# Altium project Fastino-DIOT.PrjPCB (part 8 of 8)
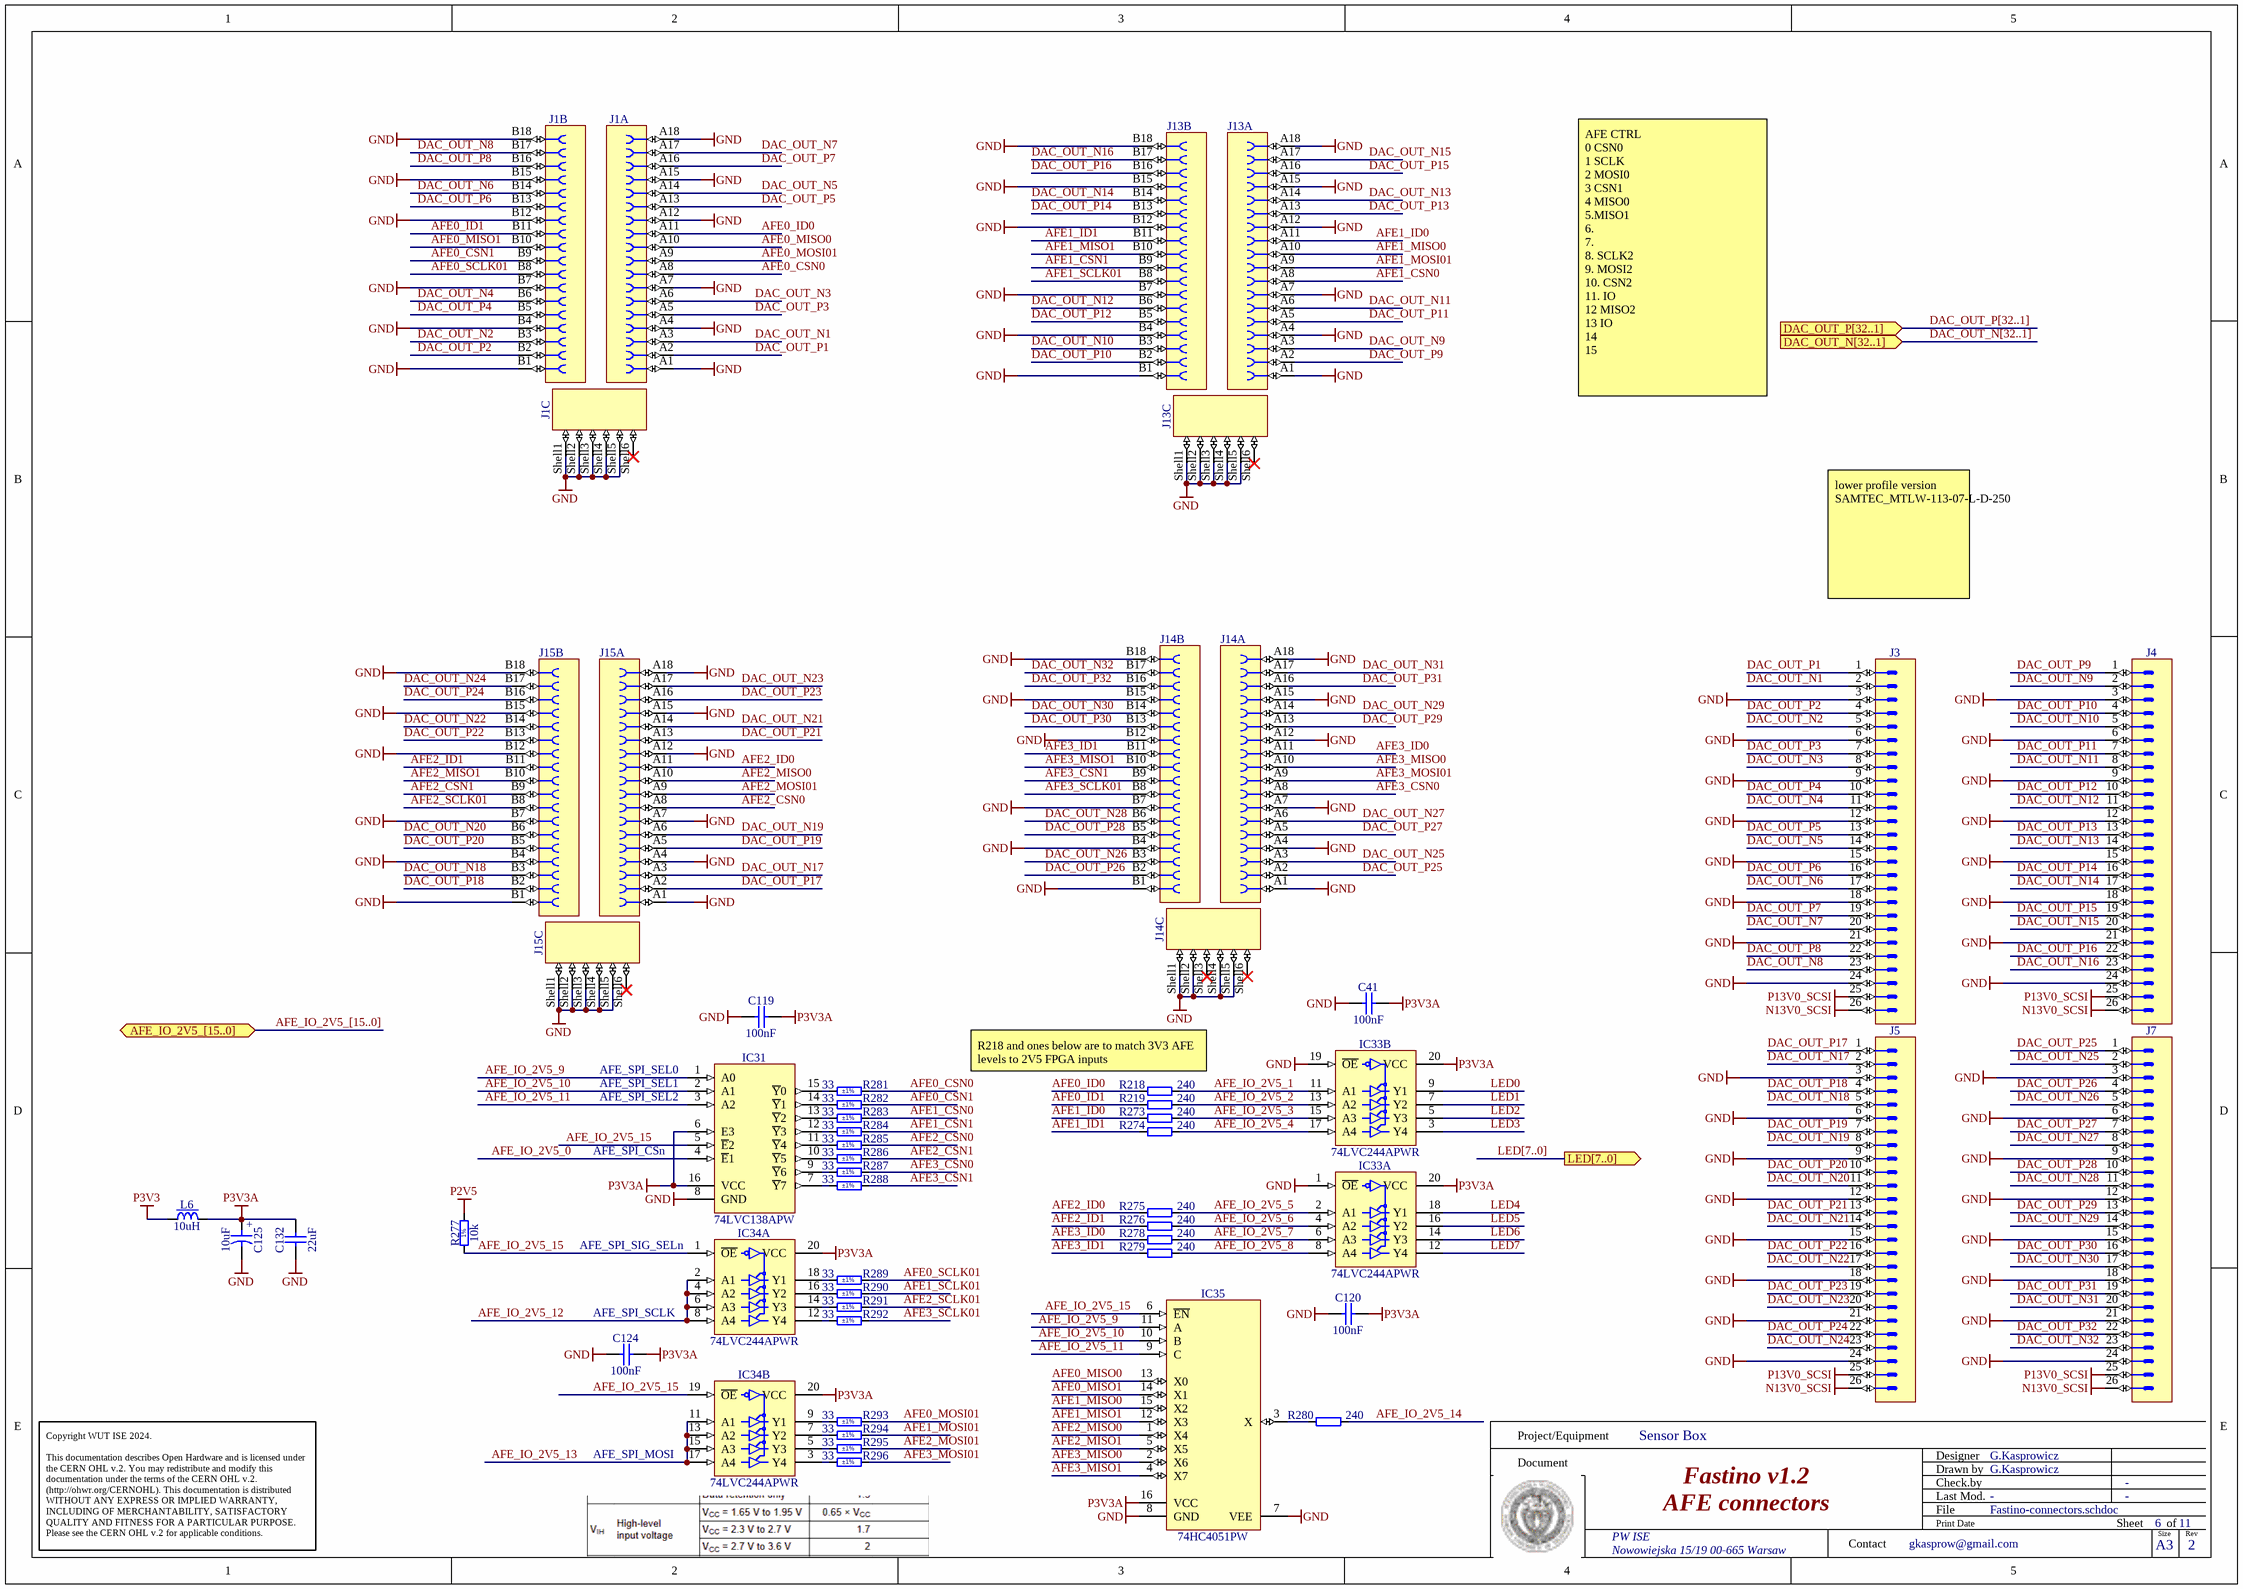
[diagram p12: Fastino-connectors.schdoc]

## Nets that join several sheets
GND: Fastino-DIOT (16 pins), DAC_channel1 (22 pins), DAC_channel2 (22 pins), DAC_channel3 (22 pins), DAC_channel4 (22 pins), DAC_channel5 (22 pins), DAC_channel6 (22 pins), DAC_channel7 (22 pins), DAC_channel8 (22 pins), DAC_channel9 (22 pins), DAC_channel10 (22 pins), DAC_channel11 (22 pins), DAC_channel12 (22 pins), DAC_channel13 (22 pins), DAC_channel14 (22 pins), DAC_channel15 (22 pins), DAC_channel16 (22 pins), DAC_channel17 (22 pins), DAC_channel18 (22 pins), DAC_channel19 (22 pins), DAC_channel20 (22 pins), DAC_channel21 (22 pins), DAC_channel22 (22 pins), DAC_channel23 (22 pins), DAC_channel24 (22 pins), DAC_channel25 (22 pins), DAC_channel26 (22 pins), DAC_channel27 (22 pins), DAC_channel28 (22 pins), DAC_channel29 (22 pins), DAC_channel30 (22 pins), DAC_channel31 (22 pins), DAC_channel32 (22 pins), Fastino_FPGA (6 pins), Fastino_FPGA_Config (18 pins), Fastino_FPGA_LVDS (42 pins), Fastino_FPGA_Supply (44 pins), Fastino_References (55 pins), Fastino_Supply (55 pins), Fastino_Supply_Switching (111 pins), Fastino_DIOT_Connectors_P1_P6 (96 pins), Fastino-connectors (112 pins)
N12V0A: DAC_channel1 (L18_1.1), DAC_channel2 (L18_2.1), DAC_channel3 (L18_3.1), DAC_channel4 (L18_4.1), DAC_channel5 (L18_5.1), DAC_channel6 (L18_6.1), DAC_channel7 (L18_7.1), DAC_channel8 (L18_8.1), DAC_channel9 (L18_9.1), DAC_channel10 (L18_10.1), DAC_channel11 (L18_11.1), DAC_channel12 (L18_12.1), DAC_channel13 (L18_13.1), DAC_channel14 (L18_14.1), DAC_channel15 (L18_15.1), DAC_channel16 (L18_16.1), DAC_channel17 (L18_17.1), DAC_channel18 (L18_18.1), DAC_channel19 (L18_19.1), DAC_channel20 (L18_20.1), DAC_channel21 (L18_21.1), DAC_channel22 (L18_22.1), DAC_channel23 (L18_23.1), DAC_channel24 (L18_24.1), DAC_channel25 (L18_25.1), DAC_channel26 (L18_26.1), DAC_channel27 (L18_27.1), DAC_channel28 (L18_28.1), DAC_channel29 (L18_29.1), DAC_channel30 (L18_30.1), DAC_channel31 (L18_31.1), DAC_channel32 (L18_32.1), Fastino_Supply (10 pins)
N13V0: Fastino-DIOT (R170.1), Fastino_Supply (5 pins), Fastino_Supply_Switching (C153.2 C156.2 L8.2)
N13V0_SCSI: Fastino-DIOT (R170.2), Fastino-connectors (J3.26 J4.26 J5.26 J7.26)
P1V2: Fastino_FPGA_Supply (16 pins), Fastino_Supply (R76.2 TP5.1), Fastino_Supply_Switching (6 pins)
P2V5: Fastino_FPGA_Supply (11 pins), Fastino_Supply (R152.2 TP10.1), Fastino_Supply_Switching (5 pins), Fastino-connectors (R277.2)
P3V3: Fastino_FPGA (C85.2 OSC1.1 OSC1.4 R53.1), Fastino_FPGA_Config (8 pins), Fastino_FPGA_LVDS (R74.1 R78.1 R84.1 R110.1), Fastino_FPGA_Supply (24 pins), Fastino_Supply (R51.1 R103.2 R159.1 TP11.1), Fastino_Supply_Switching (7 pins), Fastino-connectors (L6.1)
P3V3_buck: Fastino_Supply (R54.1), Fastino_Supply_Switching (14 pins)
P3V3_MP: Fastino-DIOT (J12.12), Fastino_FPGA_Config (15 pins), Fastino_FPGA_LVDS (22 pins), Fastino_Supply (R160.1 TP8.1), Fastino_DIOT_Connectors_P1_P6 (D7.1)
P3V3A: Fastino_FPGA_Config (LD18.2), Fastino_FPGA_LVDS (LD19.2), Fastino_Supply (LD1.2 R52.1), Fastino-connectors (12 pins)
P5V4A: DAC_channel1 (L16_1.1 R164_1.1), DAC_channel2 (L16_2.1 R164_2.1), DAC_channel3 (L16_3.1 R164_3.1), DAC_channel4 (L16_4.1 R164_4.1), DAC_channel5 (L16_5.1 R164_5.1), DAC_channel6 (L16_6.1 R164_6.1), DAC_channel7 (L16_7.1 R164_7.1), DAC_channel8 (L16_8.1 R164_8.1), DAC_channel9 (L16_9.1 R164_9.1), DAC_channel10 (L16_10.1 R164_10.1), DAC_channel11 (L16_11.1 R164_11.1), DAC_channel12 (L16_12.1 R164_12.1), DAC_channel13 (L16_13.1 R164_13.1), DAC_channel14 (L16_14.1 R164_14.1), DAC_channel15 (L16_15.1 R164_15.1), DAC_channel16 (L16_16.1 R164_16.1), DAC_channel17 (L16_17.1 R164_17.1), DAC_channel18 (L16_18.1 R164_18.1), DAC_channel19 (L16_19.1 R164_19.1), DAC_channel20 (L16_20.1 R164_20.1), DAC_channel21 (L16_21.1 R164_21.1), DAC_channel22 (L16_22.1 R164_22.1), DAC_channel23 (L16_23.1 R164_23.1), DAC_channel24 (L16_24.1 R164_24.1), DAC_channel25 (L16_25.1 R164_25.1), DAC_channel26 (L16_26.1 R164_26.1), DAC_channel27 (L16_27.1 R164_27.1), DAC_channel28 (L16_28.1 R164_28.1), DAC_channel29 (L16_29.1 R164_29.1), DAC_channel30 (L16_30.1 R164_30.1), DAC_channel31 (L16_31.1 R164_31.1), DAC_channel32 (L16_32.1 R164_32.1), Fastino_References (29 pins), Fastino_Supply (8 pins)
P6V0: Fastino_Supply (R7.1 TP13.1), Fastino_Supply_Switching (6 pins)
P6V0A: Fastino_Supply (6 pins), Fastino_Supply_Switching (C58.2 D4.1 L1.2 R28.1)
P12V0: Fastino-DIOT (J12.1 J12.3 J12.5 J12.7), Fastino_FPGA_LVDS (8 pins), Fastino_Supply (5 pins), Fastino_DIOT_Connectors_P1_P6 (J2.A3 J2.B3)
P12V0_CPCIS: Fastino_FPGA_LVDS (R268.1 R269.1 R270.1 R271.1), Fastino_DIOT_Connectors_P1_P6 (10 pins)
P12V0A: DAC_channel1 (L2_1.1), DAC_channel2 (L2_2.1), DAC_channel3 (L2_3.1), DAC_channel4 (L2_4.1), DAC_channel5 (L2_5.1), DAC_channel6 (L2_6.1), DAC_channel7 (L2_7.1), DAC_channel8 (L2_8.1), DAC_channel9 (L2_9.1), DAC_channel10 (L2_10.1), DAC_channel11 (L2_11.1), DAC_channel12 (L2_12.1), DAC_channel13 (L2_13.1), DAC_channel14 (L2_14.1), DAC_channel15 (L2_15.1), DAC_channel16 (L2_16.1), DAC_channel17 (L2_17.1), DAC_channel18 (L2_18.1), DAC_channel19 (L2_19.1), DAC_channel20 (L2_20.1), DAC_channel21 (L2_21.1), DAC_channel22 (L2_22.1), DAC_channel23 (L2_23.1), DAC_channel24 (L2_24.1), DAC_channel25 (L2_25.1), DAC_channel26 (L2_26.1), DAC_channel27 (L2_27.1), DAC_channel28 (L2_28.1), DAC_channel29 (L2_29.1), DAC_channel30 (L2_30.1), DAC_channel31 (L2_31.1), DAC_channel32 (L2_32.1), Fastino_Supply (9 pins)
P12V0F: Fastino_Supply (C34.2 C49.1 L5.2), Fastino_Supply_Switching (18 pins)
P13V0: Fastino-DIOT (R171.1), Fastino_Supply (C18.2 C112.2 IC13.1 IC13.2), Fastino_Supply_Switching (C82.2 C93.2 L4.2)
P13V0_SCSI: Fastino-DIOT (R171.2), Fastino-connectors (J3.25 J4.25 J5.25 J7.25)
Vaux1: Fastino_References (RN2.4), Fastino_DIOT_Connectors_P1_P6 (J2.A1 J2.B1 J2.D1 J2.E1)
Vaux2: Fastino_References (RN2.1), Fastino_DIOT_Connectors_P1_P6 (J2.G1 J2.H1 J2.J1 J2.K1)
AFE_IO_2V5_0: Fastino_FPGA_LVDS (U1.L3), Fastino-connectors (IC31.4)
AFE_IO_2V5_1: Fastino_FPGA_LVDS (U1.L6), Fastino-connectors (IC33.11 R218.2)
AFE_IO_2V5_2: Fastino_FPGA_LVDS (U1.M2), Fastino-connectors (IC33.13 R219.2)
AFE_IO_2V5_3: Fastino_FPGA_LVDS (U1.K5), Fastino-connectors (IC33.15 R273.2)
AFE_IO_2V5_4: Fastino_FPGA_LVDS (U1.N2), Fastino-connectors (IC33.17 R274.2)
AFE_IO_2V5_5: Fastino_FPGA_LVDS (U1.L7), Fastino-connectors (IC33.2 R275.2)
AFE_IO_2V5_6: Fastino_FPGA_LVDS (U1.M3), Fastino-connectors (IC33.4 R276.2)
AFE_IO_2V5_7: Fastino_FPGA_LVDS (U1.M6), Fastino-connectors (IC33.6 R278.2)
AFE_IO_2V5_8: Fastino_FPGA_LVDS (U1.N3), Fastino-connectors (IC33.8 R279.2)
AFE_IO_2V5_9: Fastino_FPGA_LVDS (U1.L5), Fastino-connectors (IC31.1 IC35.11)
AFE_IO_2V5_10: Fastino_FPGA_LVDS (U1.M4), Fastino-connectors (IC31.2 IC35.10)
AFE_IO_2V5_11: Fastino_FPGA_LVDS (U1.P1), Fastino-connectors (IC31.3 IC35.9)
AFE_IO_2V5_12: Fastino_FPGA_LVDS (U1.M5), Fastino-connectors (IC34.2 IC34.4 IC34.6 IC34.8)
AFE_IO_2V5_13: Fastino_FPGA_LVDS (U1.P2), Fastino-connectors (IC34.11 IC34.13 IC34.15 IC34.17)
AFE_IO_2V5_14: Fastino_FPGA_LVDS (U1.N4), Fastino-connectors (R280.2)
AFE_IO_2V5_15: Fastino_FPGA_LVDS (U1.R1), Fastino-connectors (5 pins)
BP_I2C.SCL: Fastino_FPGA_LVDS (R233.1), Fastino_DIOT_Connectors_P1_P6 (D5.3 J8.B2)
BP_I2C.SDA: Fastino_FPGA_LVDS (R3.1), Fastino_DIOT_Connectors_P1_P6 (D5.1 J8.C2)
BP_IO.LVDS_N0: Fastino_FPGA_LVDS (R252.1), Fastino_DIOT_Connectors_P1_P6 (J8.E3)
BP_IO.LVDS_N1: Fastino_FPGA_LVDS (R253.1), Fastino_DIOT_Connectors_P1_P6 (J8.B3)
BP_IO.LVDS_N2: Fastino_FPGA_LVDS (R254.1), Fastino_DIOT_Connectors_P1_P6 (J8.C4)
BP_IO.LVDS_N3: Fastino_FPGA_LVDS (R255.1), Fastino_DIOT_Connectors_P1_P6 (J8.L4)
BP_IO.LVDS_N4: Fastino_FPGA_LVDS (R256.1), Fastino_DIOT_Connectors_P1_P6 (J8.I4)
BP_IO.LVDS_N5: Fastino_FPGA_LVDS (R257.1), Fastino_DIOT_Connectors_P1_P6 (J8.K5)
BP_IO.LVDS_N6: Fastino_FPGA_LVDS (R258.1), Fastino_DIOT_Connectors_P1_P6 (J8.H5)
BP_IO.LVDS_N7: Fastino_FPGA_LVDS (R259.1), Fastino_DIOT_Connectors_P1_P6 (J8.F6)
BP_IO.LVDS_N8: Fastino_FPGA_LVDS (R260.1), Fastino_DIOT_Connectors_P1_P6 (J8.C6)
BP_IO.LVDS_N9: Fastino_FPGA_LVDS (R261.1), Fastino_DIOT_Connectors_P1_P6 (J8.L6)
BP_IO.LVDS_N10: Fastino_FPGA_LVDS (R262.1), Fastino_DIOT_Connectors_P1_P6 (J8.I6)
BP_IO.LVDS_N11: Fastino_FPGA_LVDS (R263.1), Fastino_DIOT_Connectors_P1_P6 (J9.E1)
BP_IO.LVDS_N12: Fastino_FPGA_LVDS (R264.1), Fastino_DIOT_Connectors_P1_P6 (J9.B1)
BP_IO.LVDS_N13: Fastino_FPGA_LVDS (R265.1), Fastino_DIOT_Connectors_P1_P6 (J9.K1)
BP_IO.LVDS_N14: Fastino_FPGA_LVDS (R266.1), Fastino_DIOT_Connectors_P1_P6 (J9.H1)
BP_IO.LVDS_N15: Fastino_FPGA_LVDS (R267.2), Fastino_DIOT_Connectors_P1_P6 (J8.F2)
BP_IO.LVDS_P0: Fastino_FPGA_LVDS (R235.1), Fastino_DIOT_Connectors_P1_P6 (J8.D3)
BP_IO.LVDS_P1: Fastino_FPGA_LVDS (R236.1), Fastino_DIOT_Connectors_P1_P6 (J8.A3)
BP_IO.LVDS_P2: Fastino_FPGA_LVDS (R238.1), Fastino_DIOT_Connectors_P1_P6 (J8.B4)
BP_IO.LVDS_P3: Fastino_FPGA_LVDS (R239.1), Fastino_DIOT_Connectors_P1_P6 (J8.K4)
BP_IO.LVDS_P4: Fastino_FPGA_LVDS (R240.1), Fastino_DIOT_Connectors_P1_P6 (J8.H4)
BP_IO.LVDS_P5: Fastino_FPGA_LVDS (R241.1), Fastino_DIOT_Connectors_P1_P6 (J8.J5)
BP_IO.LVDS_P6: Fastino_FPGA_LVDS (R242.1), Fastino_DIOT_Connectors_P1_P6 (J8.G5)
BP_IO.LVDS_P7: Fastino_FPGA_LVDS (R243.1), Fastino_DIOT_Connectors_P1_P6 (J8.E6)
BP_IO.LVDS_P8: Fastino_FPGA_LVDS (R244.1), Fastino_DIOT_Connectors_P1_P6 (J8.B6)
BP_IO.LVDS_P9: Fastino_FPGA_LVDS (R245.1), Fastino_DIOT_Connectors_P1_P6 (J8.K6)
BP_IO.LVDS_P10: Fastino_FPGA_LVDS (R246.1), Fastino_DIOT_Connectors_P1_P6 (J8.H6)
BP_IO.LVDS_P11: Fastino_FPGA_LVDS (R247.1), Fastino_DIOT_Connectors_P1_P6 (J9.D1)
BP_IO.LVDS_P12: Fastino_FPGA_LVDS (R248.1), Fastino_DIOT_Connectors_P1_P6 (J9.A1)
BP_IO.LVDS_P13: Fastino_FPGA_LVDS (R249.1), Fastino_DIOT_Connectors_P1_P6 (J9.J1)
BP_IO.LVDS_P14: Fastino_FPGA_LVDS (R250.1), Fastino_DIOT_Connectors_P1_P6 (J9.G1)
BP_IO.LVDS_P15: Fastino_FPGA_LVDS (R251.2), Fastino_DIOT_Connectors_P1_P6 (J8.E2)
DAC_CLK1: DAC_channel1 (C66_1.1 IC37_1.8), DAC_Series_Termination1 (R65_1.2)
DAC_CLK2: DAC_channel2 (C66_2.1 IC37_2.8), DAC_Series_Termination2 (R65_2.2)
DAC_CLK3: DAC_channel3 (C66_3.1 IC37_3.8), DAC_Series_Termination3 (R65_3.2)
DAC_CLK4: DAC_channel4 (C66_4.1 IC37_4.8), DAC_Series_Termination4 (R65_4.2)
DAC_CLK5: DAC_channel5 (C66_5.1 IC37_5.8), DAC_Series_Termination5 (R65_5.2)
DAC_CLK6: DAC_channel6 (C66_6.1 IC37_6.8), DAC_Series_Termination6 (R65_6.2)
DAC_CLK7: DAC_channel7 (C66_7.1 IC37_7.8), DAC_Series_Termination7 (R65_7.2)
DAC_CLK8: DAC_channel8 (C66_8.1 IC37_8.8), DAC_Series_Termination8 (R65_8.2)
DAC_CLK9: DAC_channel9 (C66_9.1 IC37_9.8), DAC_Series_Termination9 (R65_9.2)
DAC_CLK10: DAC_channel10 (C66_10.1 IC37_10.8), DAC_Series_Termination10 (R65_10.2)
DAC_CLK11: DAC_channel11 (C66_11.1 IC37_11.8), DAC_Series_Termination11 (R65_11.2)
DAC_CLK12: DAC_channel12 (C66_12.1 IC37_12.8), DAC_Series_Termination12 (R65_12.2)
DAC_CLK13: DAC_channel13 (C66_13.1 IC37_13.8), DAC_Series_Termination13 (R65_13.2)
DAC_CLK14: DAC_channel14 (C66_14.1 IC37_14.8), DAC_Series_Termination14 (R65_14.2)
DAC_CLK15: DAC_channel15 (C66_15.1 IC37_15.8), DAC_Series_Termination15 (R65_15.2)
DAC_CLK16: DAC_channel16 (C66_16.1 IC37_16.8), DAC_Series_Termination16 (R65_16.2)
DAC_CLK17: DAC_channel17 (C66_17.1 IC37_17.8), DAC_Series_Termination17 (R65_17.2)
DAC_CLK18: DAC_channel18 (C66_18.1 IC37_18.8), DAC_Series_Termination18 (R65_18.2)
DAC_CLK19: DAC_channel19 (C66_19.1 IC37_19.8), DAC_Series_Termination19 (R65_19.2)
DAC_CLK20: DAC_channel20 (C66_20.1 IC37_20.8), DAC_Series_Termination20 (R65_20.2)
DAC_CLK21: DAC_channel21 (C66_21.1 IC37_21.8), DAC_Series_Termination21 (R65_21.2)
DAC_CLK22: DAC_channel22 (C66_22.1 IC37_22.8), DAC_Series_Termination22 (R65_22.2)
DAC_CLK23: DAC_channel23 (C66_23.1 IC37_23.8), DAC_Series_Termination23 (R65_23.2)
DAC_CLK24: DAC_channel24 (C66_24.1 IC37_24.8), DAC_Series_Termination24 (R65_24.2)
DAC_CLK25: DAC_channel25 (C66_25.1 IC37_25.8), DAC_Series_Termination25 (R65_25.2)
DAC_CLK26: DAC_channel26 (C66_26.1 IC37_26.8), DAC_Series_Termination26 (R65_26.2)
DAC_CLK27: DAC_channel27 (C66_27.1 IC37_27.8), DAC_Series_Termination27 (R65_27.2)
DAC_CLK28: DAC_channel28 (C66_28.1 IC37_28.8), DAC_Series_Termination28 (R65_28.2)
DAC_CLK29: DAC_channel29 (C66_29.1 IC37_29.8), DAC_Series_Termination29 (R65_29.2)
DAC_CLK30: DAC_channel30 (C66_30.1 IC37_30.8), DAC_Series_Termination30 (R65_30.2)
DAC_CLK31: DAC_channel31 (C66_31.1 IC37_31.8), DAC_Series_Termination31 (R65_31.2)
DAC_CLK32: Fastino-DIOT (TP4.1), DAC_channel32 (C66_32.1 IC37_32.8), DAC_Series_Termination32 (R65_32.2)
DAC_LDACn1: DAC_channel1 (C89_1.1 IC37_1.11), DAC_Series_Termination1 (R80_1.2)
DAC_LDACn2: DAC_channel2 (C89_2.1 IC37_2.11), DAC_Series_Termination2 (R80_2.2)
DAC_LDACn3: DAC_channel3 (C89_3.1 IC37_3.11), DAC_Series_Termination3 (R80_3.2)
DAC_LDACn4: DAC_channel4 (C89_4.1 IC37_4.11), DAC_Series_Termination4 (R80_4.2)
DAC_LDACn5: DAC_channel5 (C89_5.1 IC37_5.11), DAC_Series_Termination5 (R80_5.2)
DAC_LDACn6: DAC_channel6 (C89_6.1 IC37_6.11), DAC_Series_Termination6 (R80_6.2)
DAC_LDACn7: DAC_channel7 (C89_7.1 IC37_7.11), DAC_Series_Termination7 (R80_7.2)
DAC_LDACn8: DAC_channel8 (C89_8.1 IC37_8.11), DAC_Series_Termination8 (R80_8.2)
DAC_LDACn9: DAC_channel9 (C89_9.1 IC37_9.11), DAC_Series_Termination9 (R80_9.2)
DAC_LDACn10: DAC_channel10 (C89_10.1 IC37_10.11), DAC_Series_Termination10 (R80_10.2)
DAC_LDACn11: DAC_channel11 (C89_11.1 IC37_11.11), DAC_Series_Termination11 (R80_11.2)
DAC_LDACn12: DAC_channel12 (C89_12.1 IC37_12.11), DAC_Series_Termination12 (R80_12.2)
DAC_LDACn13: DAC_channel13 (C89_13.1 IC37_13.11), DAC_Series_Termination13 (R80_13.2)
DAC_LDACn14: DAC_channel14 (C89_14.1 IC37_14.11), DAC_Series_Termination14 (R80_14.2)
DAC_LDACn15: DAC_channel15 (C89_15.1 IC37_15.11), DAC_Series_Termination15 (R80_15.2)
DAC_LDACn16: DAC_channel16 (C89_16.1 IC37_16.11), DAC_Series_Termination16 (R80_16.2)
DAC_LDACn17: DAC_channel17 (C89_17.1 IC37_17.11), DAC_Series_Termination17 (R80_17.2)
DAC_LDACn18: DAC_channel18 (C89_18.1 IC37_18.11), DAC_Series_Termination18 (R80_18.2)
DAC_LDACn19: DAC_channel19 (C89_19.1 IC37_19.11), DAC_Series_Termination19 (R80_19.2)
DAC_LDACn20: DAC_channel20 (C89_20.1 IC37_20.11), DAC_Series_Termination20 (R80_20.2)
DAC_LDACn21: DAC_channel21 (C89_21.1 IC37_21.11), DAC_Series_Termination21 (R80_21.2)
DAC_LDACn22: DAC_channel22 (C89_22.1 IC37_22.11), DAC_Series_Termination22 (R80_22.2)
DAC_LDACn23: DAC_channel23 (C89_23.1 IC37_23.11), DAC_Series_Termination23 (R80_23.2)
DAC_LDACn24: DAC_channel24 (C89_24.1 IC37_24.11), DAC_Series_Termination24 (R80_24.2)
DAC_LDACn25: DAC_channel25 (C89_25.1 IC37_25.11), DAC_Series_Termination25 (R80_25.2)
DAC_LDACn26: DAC_channel26 (C89_26.1 IC37_26.11), DAC_Series_Termination26 (R80_26.2)
DAC_LDACn27: DAC_channel27 (C89_27.1 IC37_27.11), DAC_Series_Termination27 (R80_27.2)
DAC_LDACn28: DAC_channel28 (C89_28.1 IC37_28.11), DAC_Series_Termination28 (R80_28.2)
DAC_LDACn29: DAC_channel29 (C89_29.1 IC37_29.11), DAC_Series_Termination29 (R80_29.2)
DAC_LDACn30: DAC_channel30 (C89_30.1 IC37_30.11), DAC_Series_Termination30 (R80_30.2)
DAC_LDACn31: DAC_channel31 (C89_31.1 IC37_31.11), DAC_Series_Termination31 (R80_31.2)
DAC_LDACn32: Fastino-DIOT (TP19.1), DAC_channel32 (C89_32.1 IC37_32.11), DAC_Series_Termination32 (R80_32.2)
DAC_MOSI1: DAC_channel1 (C68_1.1 IC37_1.9), DAC_Series_Termination1 (R69_1.2)
DAC_MOSI2: DAC_channel2 (C68_2.1 IC37_2.9), DAC_Series_Termination2 (R69_2.2)
DAC_MOSI3: DAC_channel3 (C68_3.1 IC37_3.9), DAC_Series_Termination3 (R69_3.2)
DAC_MOSI4: DAC_channel4 (C68_4.1 IC37_4.9), DAC_Series_Termination4 (R69_4.2)
DAC_MOSI5: DAC_channel5 (C68_5.1 IC37_5.9), DAC_Series_Termination5 (R69_5.2)
DAC_MOSI6: DAC_channel6 (C68_6.1 IC37_6.9), DAC_Series_Termination6 (R69_6.2)
DAC_MOSI7: DAC_channel7 (C68_7.1 IC37_7.9), DAC_Series_Termination7 (R69_7.2)
DAC_MOSI8: DAC_channel8 (C68_8.1 IC37_8.9), DAC_Series_Termination8 (R69_8.2)
DAC_MOSI9: DAC_channel9 (C68_9.1 IC37_9.9), DAC_Series_Termination9 (R69_9.2)
DAC_MOSI10: DAC_channel10 (C68_10.1 IC37_10.9), DAC_Series_Termination10 (R69_10.2)
DAC_MOSI11: DAC_channel11 (C68_11.1 IC37_11.9), DAC_Series_Termination11 (R69_11.2)
DAC_MOSI12: DAC_channel12 (C68_12.1 IC37_12.9), DAC_Series_Termination12 (R69_12.2)
DAC_MOSI13: DAC_channel13 (C68_13.1 IC37_13.9), DAC_Series_Termination13 (R69_13.2)
DAC_MOSI14: DAC_channel14 (C68_14.1 IC37_14.9), DAC_Series_Termination14 (R69_14.2)
DAC_MOSI15: DAC_channel15 (C68_15.1 IC37_15.9), DAC_Series_Termination15 (R69_15.2)
DAC_MOSI16: DAC_channel16 (C68_16.1 IC37_16.9), DAC_Series_Termination16 (R69_16.2)
DAC_MOSI17: DAC_channel17 (C68_17.1 IC37_17.9), DAC_Series_Termination17 (R69_17.2)
DAC_MOSI18: DAC_channel18 (C68_18.1 IC37_18.9), DAC_Series_Termination18 (R69_18.2)
DAC_MOSI19: DAC_channel19 (C68_19.1 IC37_19.9), DAC_Series_Termination19 (R69_19.2)
DAC_MOSI20: DAC_channel20 (C68_20.1 IC37_20.9), DAC_Series_Termination20 (R69_20.2)
DAC_MOSI21: DAC_channel21 (C68_21.1 IC37_21.9), DAC_Series_Termination21 (R69_21.2)
DAC_MOSI22: DAC_channel22 (C68_22.1 IC37_22.9), DAC_Series_Termination22 (R69_22.2)
DAC_MOSI23: DAC_channel23 (C68_23.1 IC37_23.9), DAC_Series_Termination23 (R69_23.2)
DAC_MOSI24: DAC_channel24 (C68_24.1 IC37_24.9), DAC_Series_Termination24 (R69_24.2)
DAC_MOSI25: DAC_channel25 (C68_25.1 IC37_25.9), DAC_Series_Termination25 (R69_25.2)
DAC_MOSI26: DAC_channel26 (C68_26.1 IC37_26.9), DAC_Series_Termination26 (R69_26.2)
DAC_MOSI27: DAC_channel27 (C68_27.1 IC37_27.9), DAC_Series_Termination27 (R69_27.2)
DAC_MOSI28: DAC_channel28 (C68_28.1 IC37_28.9), DAC_Series_Termination28 (R69_28.2)
DAC_MOSI29: DAC_channel29 (C68_29.1 IC37_29.9), DAC_Series_Termination29 (R69_29.2)
DAC_MOSI30: DAC_channel30 (C68_30.1 IC37_30.9), DAC_Series_Termination30 (R69_30.2)
DAC_MOSI31: DAC_channel31 (C68_31.1 IC37_31.9), DAC_Series_Termination31 (R69_31.2)
DAC_MOSI32: Fastino-DIOT (TP18.1), DAC_channel32 (C68_32.1 IC37_32.9), DAC_Series_Termination32 (R69_32.2)
DAC_NSS1: DAC_channel1 (C35_1.1 IC37_1.6), DAC_Series_Termination1 (R66_1.2)
DAC_NSS2: DAC_channel2 (C35_2.1 IC37_2.6), DAC_Series_Termination2 (R66_2.2)
DAC_NSS3: DAC_channel3 (C35_3.1 IC37_3.6), DAC_Series_Termination3 (R66_3.2)
DAC_NSS4: DAC_channel4 (C35_4.1 IC37_4.6), DAC_Series_Termination4 (R66_4.2)
DAC_NSS5: DAC_channel5 (C35_5.1 IC37_5.6), DAC_Series_Termination5 (R66_5.2)
DAC_NSS6: DAC_channel6 (C35_6.1 IC37_6.6), DAC_Series_Termination6 (R66_6.2)
DAC_NSS7: DAC_channel7 (C35_7.1 IC37_7.6), DAC_Series_Termination7 (R66_7.2)
DAC_NSS8: DAC_channel8 (C35_8.1 IC37_8.6), DAC_Series_Termination8 (R66_8.2)
DAC_NSS9: DAC_channel9 (C35_9.1 IC37_9.6), DAC_Series_Termination9 (R66_9.2)
DAC_NSS10: DAC_channel10 (C35_10.1 IC37_10.6), DAC_Series_Termination10 (R66_10.2)
DAC_NSS11: DAC_channel11 (C35_11.1 IC37_11.6), DAC_Series_Termination11 (R66_11.2)
DAC_NSS12: DAC_channel12 (C35_12.1 IC37_12.6), DAC_Series_Termination12 (R66_12.2)
DAC_NSS13: DAC_channel13 (C35_13.1 IC37_13.6), DAC_Series_Termination13 (R66_13.2)
DAC_NSS14: DAC_channel14 (C35_14.1 IC37_14.6), DAC_Series_Termination14 (R66_14.2)
DAC_NSS15: DAC_channel15 (C35_15.1 IC37_15.6), DAC_Series_Termination15 (R66_15.2)
DAC_NSS16: DAC_channel16 (C35_16.1 IC37_16.6), DAC_Series_Termination16 (R66_16.2)
DAC_NSS17: DAC_channel17 (C35_17.1 IC37_17.6), DAC_Series_Termination17 (R66_17.2)
DAC_NSS18: DAC_channel18 (C35_18.1 IC37_18.6), DAC_Series_Termination18 (R66_18.2)
DAC_NSS19: DAC_channel19 (C35_19.1 IC37_19.6), DAC_Series_Termination19 (R66_19.2)
DAC_NSS20: DAC_channel20 (C35_20.1 IC37_20.6), DAC_Series_Termination20 (R66_20.2)
DAC_NSS21: DAC_channel21 (C35_21.1 IC37_21.6), DAC_Series_Termination21 (R66_21.2)
DAC_NSS22: DAC_channel22 (C35_22.1 IC37_22.6), DAC_Series_Termination22 (R66_22.2)
DAC_NSS23: DAC_channel23 (C35_23.1 IC37_23.6), DAC_Series_Termination23 (R66_23.2)
DAC_NSS24: DAC_channel24 (C35_24.1 IC37_24.6), DAC_Series_Termination24 (R66_24.2)
DAC_NSS25: DAC_channel25 (C35_25.1 IC37_25.6), DAC_Series_Termination25 (R66_25.2)
DAC_NSS26: DAC_channel26 (C35_26.1 IC37_26.6), DAC_Series_Termination26 (R66_26.2)
DAC_NSS27: DAC_channel27 (C35_27.1 IC37_27.6), DAC_Series_Termination27 (R66_27.2)
DAC_NSS28: DAC_channel28 (C35_28.1 IC37_28.6), DAC_Series_Termination28 (R66_28.2)
DAC_NSS29: DAC_channel29 (C35_29.1 IC37_29.6), DAC_Series_Termination29 (R66_29.2)
DAC_NSS30: DAC_channel30 (C35_30.1 IC37_30.6), DAC_Series_Termination30 (R66_30.2)
DAC_NSS31: DAC_channel31 (C35_31.1 IC37_31.6), DAC_Series_Termination31 (R66_31.2)
DAC_NSS32: Fastino-DIOT (TP15.1), DAC_channel32 (C35_32.1 IC37_32.6), DAC_Series_Termination32 (R66_32.2)
DAC_OUT_N: DAC_channel1 (R67_1.2), Fastino-connectors (J1.A3 J3.2)
DAC_OUT_N: DAC_channel2 (R67_2.2), Fastino-connectors (J1.B3 J3.5)
DAC_OUT_N: DAC_channel3 (R67_3.2), Fastino-connectors (J1.A6 J3.8)
DAC_OUT_N: DAC_channel4 (R67_4.2), Fastino-connectors (J1.B6 J3.11)
DAC_OUT_N: DAC_channel5 (R67_5.2), Fastino-connectors (J1.A14 J3.14)
DAC_OUT_N: DAC_channel6 (R67_6.2), Fastino-connectors (J1.B14 J3.17)
DAC_OUT_N: DAC_channel7 (R67_7.2), Fastino-connectors (J1.A17 J3.20)
DAC_OUT_N: DAC_channel8 (R67_8.2), Fastino-connectors (J1.B17 J3.23)
DAC_OUT_N: DAC_channel9 (R67_9.2), Fastino-connectors (J4.2 J13.A3)
DAC_OUT_N: DAC_channel10 (R67_10.2), Fastino-connectors (J4.5 J13.B3)
DAC_OUT_N: DAC_channel11 (R67_11.2), Fastino-connectors (J4.8 J13.A6)
DAC_OUT_N: DAC_channel12 (R67_12.2), Fastino-connectors (J4.11 J13.B6)
DAC_OUT_N: DAC_channel13 (R67_13.2), Fastino-connectors (J4.14 J13.A14)
DAC_OUT_N: DAC_channel14 (R67_14.2), Fastino-connectors (J4.17 J13.B14)
DAC_OUT_N: DAC_channel15 (R67_15.2), Fastino-connectors (J4.20 J13.A17)
DAC_OUT_N: DAC_channel16 (R67_16.2), Fastino-connectors (J4.23 J13.B17)
DAC_OUT_N: DAC_channel17 (R67_17.2), Fastino-connectors (J5.2 J15.A3)
DAC_OUT_N: DAC_channel18 (R67_18.2), Fastino-connectors (J5.5 J15.B3)
DAC_OUT_N: DAC_channel19 (R67_19.2), Fastino-connectors (J5.8 J15.A6)
DAC_OUT_N: DAC_channel20 (R67_20.2), Fastino-connectors (J5.11 J15.B6)
DAC_OUT_N: DAC_channel21 (R67_21.2), Fastino-connectors (J5.14 J15.A14)
DAC_OUT_N: DAC_channel22 (R67_22.2), Fastino-connectors (J5.17 J15.B14)
DAC_OUT_N: DAC_channel23 (R67_23.2), Fastino-connectors (J5.20 J15.A17)
DAC_OUT_N: DAC_channel24 (R67_24.2), Fastino-connectors (J5.23 J15.B17)
DAC_OUT_N: DAC_channel25 (R67_25.2), Fastino-connectors (J7.2 J14.A3)
DAC_OUT_N: DAC_channel26 (R67_26.2), Fastino-connectors (J7.5 J14.B3)
DAC_OUT_N: DAC_channel27 (R67_27.2), Fastino-connectors (J7.8 J14.A6)
DAC_OUT_N: DAC_channel28 (R67_28.2), Fastino-connectors (J7.11 J14.B6)
DAC_OUT_N: DAC_channel29 (R67_29.2), Fastino-connectors (J7.14 J14.A14)
DAC_OUT_N: DAC_channel30 (R67_30.2), Fastino-connectors (J7.17 J14.B14)
DAC_OUT_N: DAC_channel31 (R67_31.2), Fastino-connectors (J7.20 J14.A17)
DAC_OUT_N: DAC_channel32 (R67_32.2), Fastino-connectors (J7.23 J14.B17)
DAC_OUT_P: DAC_channel1 (D21_1.3 R2_1.2), Fastino-connectors (J1.A2 J3.1)
DAC_OUT_P: DAC_channel2 (D21_2.3 R2_2.2), Fastino-connectors (J1.B2 J3.4)
DAC_OUT_P: DAC_channel3 (D21_3.3 R2_3.2), Fastino-connectors (J1.A5 J3.7)
DAC_OUT_P: DAC_channel4 (D21_4.3 R2_4.2), Fastino-connectors (J1.B5 J3.10)
DAC_OUT_P: DAC_channel5 (D21_5.3 R2_5.2), Fastino-connectors (J1.A13 J3.13)
DAC_OUT_P: DAC_channel6 (D21_6.3 R2_6.2), Fastino-connectors (J1.B13 J3.16)
DAC_OUT_P: DAC_channel7 (D21_7.3 R2_7.2), Fastino-connectors (J1.A16 J3.19)
DAC_OUT_P: DAC_channel8 (D21_8.3 R2_8.2), Fastino-connectors (J1.B16 J3.22)
DAC_OUT_P: DAC_channel9 (D21_9.3 R2_9.2), Fastino-connectors (J4.1 J13.A2)
DAC_OUT_P: DAC_channel10 (D21_10.3 R2_10.2), Fastino-connectors (J4.4 J13.B2)
DAC_OUT_P: DAC_channel11 (D21_11.3 R2_11.2), Fastino-connectors (J4.7 J13.A5)
DAC_OUT_P: DAC_channel12 (D21_12.3 R2_12.2), Fastino-connectors (J4.10 J13.B5)
DAC_OUT_P: DAC_channel13 (D21_13.3 R2_13.2), Fastino-connectors (J4.13 J13.A13)
DAC_OUT_P: DAC_channel14 (D21_14.3 R2_14.2), Fastino-connectors (J4.16 J13.B13)
DAC_OUT_P: DAC_channel15 (D21_15.3 R2_15.2), Fastino-connectors (J4.19 J13.A16)
DAC_OUT_P: DAC_channel16 (D21_16.3 R2_16.2), Fastino-connectors (J4.22 J13.B16)
DAC_OUT_P: DAC_channel17 (D21_17.3 R2_17.2), Fastino-connectors (J5.1 J15.A2)
DAC_OUT_P: DAC_channel18 (D21_18.3 R2_18.2), Fastino-connectors (J5.4 J15.B2)
DAC_OUT_P: DAC_channel19 (D21_19.3 R2_19.2), Fastino-connectors (J5.7 J15.A5)
DAC_OUT_P: DAC_channel20 (D21_20.3 R2_20.2), Fastino-connectors (J5.10 J15.B5)
DAC_OUT_P: DAC_channel21 (D21_21.3 R2_21.2), Fastino-connectors (J5.13 J15.A13)
DAC_OUT_P: DAC_channel22 (D21_22.3 R2_22.2), Fastino-connectors (J5.16 J15.B13)
DAC_OUT_P: DAC_channel23 (D21_23.3 R2_23.2), Fastino-connectors (J5.19 J15.A16)
DAC_OUT_P: DAC_channel24 (D21_24.3 R2_24.2), Fastino-connectors (J5.22 J15.B16)
DAC_OUT_P: DAC_channel25 (D21_25.3 R2_25.2), Fastino-connectors (J7.1 J14.A2)
DAC_OUT_P: DAC_channel26 (D21_26.3 R2_26.2), Fastino-connectors (J7.4 J14.B2)
DAC_OUT_P: DAC_channel27 (D21_27.3 R2_27.2), Fastino-connectors (J7.7 J14.A5)
DAC_OUT_P: DAC_channel28 (D21_28.3 R2_28.2), Fastino-connectors (J7.10 J14.B5)
DAC_OUT_P: DAC_channel29 (D21_29.3 R2_29.2), Fastino-connectors (J7.13 J14.A13)
DAC_OUT_P: DAC_channel30 (D21_30.3 R2_30.2), Fastino-connectors (J7.16 J14.B13)
DAC_OUT_P: DAC_channel31 (D21_31.3 R2_31.2), Fastino-connectors (J7.19 J14.A16)
DAC_OUT_P: DAC_channel32 (D21_32.3 R2_32.2), Fastino-connectors (J7.22 J14.B16)
DAC_REF_P5V1: DAC_channel1 (6 pins), Fastino_References (R1.2)
DAC_REF_P5V2: DAC_channel2 (6 pins), Fastino_References (R16.2)
DAC_REF_P5V3: DAC_channel3 (6 pins), Fastino_References (R272.2)
DAC_REF_P5V4: DAC_channel4 (6 pins), Fastino_References (R34.2)
DAC_REF_P5V5: DAC_channel5 (6 pins), Fastino_References (R4.2)
DAC_REF_P5V6: DAC_channel6 (6 pins), Fastino_References (R58.2)
DAC_REF_P5V7: DAC_channel7 (6 pins), Fastino_References (R5.2)
DAC_REF_P5V8: DAC_channel8 (6 pins), Fastino_References (R62.2)
DAC_REF_P5V9: DAC_channel9 (6 pins), Fastino_References (R141.2)
DAC_REF_P5V10: DAC_channel10 (6 pins), Fastino_References (R6.2)
DAC_REF_P5V11: DAC_channel11 (6 pins), Fastino_References (R105.2)
DAC_REF_P5V12: DAC_channel12 (6 pins), Fastino_References (R144.2)
DAC_REF_P5V13: DAC_channel13 (6 pins), Fastino_References (R10.2)
DAC_REF_P5V14: DAC_channel14 (6 pins), Fastino_References (R106.2)
DAC_REF_P5V15: DAC_channel15 (6 pins), Fastino_References (R146.2)
DAC_REF_P5V16: DAC_channel16 (6 pins), Fastino_References (R12.2)
DAC_REF_P5V17: DAC_channel17 (6 pins), Fastino_References (R116.2)
DAC_REF_P5V18: DAC_channel18 (6 pins), Fastino_References (R147.2)
DAC_REF_P5V19: DAC_channel19 (6 pins), Fastino_References (R14.2)
DAC_REF_P5V20: DAC_channel20 (6 pins), Fastino_References (R118.2)
DAC_REF_P5V21: DAC_channel21 (6 pins), Fastino_References (R148.2)
DAC_REF_P5V22: DAC_channel22 (6 pins), Fastino_References (R124.2)
DAC_REF_P5V23: DAC_channel23 (6 pins), Fastino_References (R128.2)
DAC_REF_P5V24: DAC_channel24 (6 pins), Fastino_References (R149.2)
DAC_REF_P5V25: DAC_channel25 (6 pins), Fastino_References (R129.2)
DAC_REF_P5V26: DAC_channel26 (6 pins), Fastino_References (R130.2)
DAC_REF_P5V27: DAC_channel27 (6 pins), Fastino_References (R150.2)
DAC_REF_P5V28: DAC_channel28 (6 pins), Fastino_References (R131.2)
DAC_REF_P5V29: DAC_channel29 (6 pins), Fastino_References (R132.2)
DAC_REF_P5V30: DAC_channel30 (6 pins), Fastino_References (R163.2)
DAC_REF_P5V31: DAC_channel31 (6 pins), Fastino_References (R133.2)
DAC_REF_P5V32: DAC_channel32 (6 pins), Fastino_References (R136.2)
DAC_SPI_CLK1: Fastino_FPGA (U1.C3), DAC_Series_Termination1 (R65_1.1)
DAC_SPI_CLK2: Fastino_FPGA (U1.B3), DAC_Series_Termination2 (R65_2.1)
DAC_SPI_CLK3: Fastino_FPGA (U1.D5), DAC_Series_Termination3 (R65_3.1)
DAC_SPI_CLK4: Fastino_FPGA (U1.A5), DAC_Series_Termination4 (R65_4.1)
DAC_SPI_CLK5: Fastino_FPGA (U1.C6), DAC_Series_Termination5 (R65_5.1)
DAC_SPI_CLK6: Fastino_FPGA (U1.B9), DAC_Series_Termination6 (R65_6.1)
DAC_SPI_CLK7: Fastino_FPGA (U1.D9), DAC_Series_Termination7 (R65_7.1)
DAC_SPI_CLK8: Fastino_FPGA (U1.A11), DAC_Series_Termination8 (R65_8.1)
DAC_SPI_CLK9: Fastino_FPGA (U1.R3), DAC_Series_Termination9 (R65_9.1)
DAC_SPI_CLK10: Fastino_FPGA (U1.B10), DAC_Series_Termination10 (R65_10.1)
DAC_SPI_CLK11: Fastino_FPGA (U1.E10), DAC_Series_Termination11 (R65_11.1)
DAC_SPI_CLK12: Fastino_FPGA (U1.P7), DAC_Series_Termination12 (R65_12.1)
DAC_SPI_CLK13: Fastino_FPGA (U1.B15), DAC_Series_Termination13 (R65_13.1)
DAC_SPI_CLK14: Fastino_FPGA (U1.H11), DAC_Series_Termination14 (R65_14.1)
DAC_SPI_CLK15: Fastino_FPGA (U1.R9), DAC_Series_Termination15 (R65_15.1)
DAC_SPI_CLK16: Fastino_FPGA (U1.E11), DAC_Series_Termination16 (R65_16.1)
DAC_SPI_CLK17: Fastino_FPGA (U1.H12), DAC_Series_Termination17 (R65_17.1)
DAC_SPI_CLK18: Fastino_FPGA (U1.M11), DAC_Series_Termination18 (R65_18.1)
DAC_SPI_CLK19: Fastino_FPGA (U1.F12), DAC_Series_Termination19 (R65_19.1)
DAC_SPI_CLK20: Fastino_FPGA (U1.J14), DAC_Series_Termination20 (R65_20.1)
DAC_SPI_CLK21: Fastino_FPGA (U1.P15), DAC_Series_Termination21 (R65_21.1)
DAC_SPI_CLK22: Fastino_FPGA (U1.F13), DAC_Series_Termination22 (R65_22.1)
DAC_SPI_CLK23: Fastino_FPGA (U1.L12), DAC_Series_Termination23 (R65_23.1)
DAC_SPI_CLK24: Fastino_FPGA (U1.N10), DAC_Series_Termination24 (R65_24.1)
DAC_SPI_CLK25: Fastino_FPGA (U1.G11), DAC_Series_Termination25 (R65_25.1)
DAC_SPI_CLK26: Fastino_FPGA (U1.K13), DAC_Series_Termination26 (R65_26.1)
DAC_SPI_CLK27: Fastino_FPGA (U1.T6), DAC_Series_Termination27 (R65_27.1)
DAC_SPI_CLK28: Fastino_FPGA (U1.G13), DAC_Series_Termination28 (R65_28.1)
DAC_SPI_CLK29: Fastino_FPGA (U1.K12), DAC_Series_Termination29 (R65_29.1)
DAC_SPI_CLK30: Fastino_FPGA (U1.P6), DAC_Series_Termination30 (R65_30.1)
DAC_SPI_CLK31: Fastino_FPGA (U1.M12), DAC_Series_Termination31 (R65_31.1)
DAC_SPI_CLK32: Fastino_FPGA (U1.R2), DAC_Series_Termination32 (R65_32.1)
DAC_SPI_CLRn: Fastino-DIOT (TP20.1), DAC_channel1 (IC37_1.10), DAC_channel2 (IC37_2.10), DAC_channel3 (IC37_3.10), DAC_channel4 (IC37_4.10), DAC_channel5 (IC37_5.10), DAC_channel6 (IC37_6.10), DAC_channel7 (IC37_7.10), DAC_channel8 (IC37_8.10), DAC_channel9 (IC37_9.10), DAC_channel10 (IC37_10.10), DAC_channel11 (IC37_11.10), DAC_channel12 (IC37_12.10), DAC_channel13 (IC37_13.10), DAC_channel14 (IC37_14.10), DAC_channel15 (IC37_15.10), DAC_channel16 (IC37_16.10), DAC_channel17 (IC37_17.10), DAC_channel18 (IC37_18.10), DAC_channel19 (IC37_19.10), DAC_channel20 (IC37_20.10), DAC_channel21 (IC37_21.10), DAC_channel22 (IC37_22.10), DAC_channel23 (IC37_23.10), DAC_channel24 (IC37_24.10), DAC_channel25 (IC37_25.10), DAC_channel26 (IC37_26.10), DAC_channel27 (IC37_27.10), DAC_channel28 (IC37_28.10), DAC_channel29 (IC37_29.10), DAC_channel30 (IC37_30.10), DAC_channel31 (IC37_31.10), DAC_channel32 (IC37_32.10), Fastino_FPGA (U1.A7)
DAC_SPI_LDACn1: Fastino_FPGA (U1.D4), DAC_Series_Termination1 (R80_1.1)
DAC_SPI_LDACn2: Fastino_FPGA (U1.A1), DAC_Series_Termination2 (R80_2.1)
DAC_SPI_LDACn3: Fastino_FPGA (U1.B5), DAC_Series_Termination3 (R80_3.1)
DAC_SPI_LDACn4: Fastino_FPGA (U1.D7), DAC_Series_Termination4 (R80_4.1)
DAC_SPI_LDACn5: Fastino_FPGA (U1.B7), DAC_Series_Termination5 (R80_5.1)
DAC_SPI_LDACn6: Fastino_FPGA (U1.C8), DAC_Series_Termination6 (R80_6.1)
DAC_SPI_LDACn7: Fastino_FPGA (U1.C9), DAC_Series_Termination7 (R80_7.1)
DAC_SPI_LDACn8: Fastino_FPGA (U1.C10), DAC_Series_Termination8 (R80_8.1)
DAC_SPI_LDACn9: Fastino_FPGA (U1.N5), DAC_Series_Termination9 (R80_9.1)
DAC_SPI_LDACn10: Fastino_FPGA (U1.D11), DAC_Series_Termination10 (R80_10.1)
DAC_SPI_LDACn11: Fastino_FPGA (U1.A15), DAC_Series_Termination11 (R80_11.1)
DAC_SPI_LDACn12: Fastino_FPGA (U1.L9), DAC_Series_Termination12 (R80_12.1)
DAC_SPI_LDACn13: Fastino_FPGA (U1.E13), DAC_Series_Termination13 (R80_13.1)
DAC_SPI_LDACn14: Fastino_FPGA (U1.J16), DAC_Series_Termination14 (R80_14.1)
DAC_SPI_LDACn15: Fastino_FPGA (U1.N9), DAC_Series_Termination15 (R80_15.1)
DAC_SPI_LDACn16: Fastino_FPGA (U1.B14), DAC_Series_Termination16 (R80_16.1)
DAC_SPI_LDACn17: Fastino_FPGA (U1.H14), DAC_Series_Termination17 (R80_17.1)
DAC_SPI_LDACn18: Fastino_FPGA (U1.T10), DAC_Series_Termination18 (R80_18.1)
DAC_SPI_LDACn19: Fastino_FPGA (U1.G12), DAC_Series_Termination19 (R80_19.1)
DAC_SPI_LDACn20: Fastino_FPGA (U1.J15), DAC_Series_Termination20 (R80_20.1)
DAC_SPI_LDACn21: Fastino_FPGA (U1.R14), DAC_Series_Termination21 (R80_21.1)
DAC_SPI_LDACn22: Fastino_FPGA (U1.F11), DAC_Series_Termination22 (R80_22.1)
DAC_SPI_LDACn23: Fastino_FPGA (U1.M13), DAC_Series_Termination23 (R80_23.1)
DAC_SPI_LDACn24: Fastino_FPGA (U1.R10), DAC_Series_Termination24 (R80_24.1)
DAC_SPI_LDACn25: Fastino_FPGA (U1.G10), DAC_Series_Termination25 (R80_25.1)
DAC_SPI_LDACn26: Fastino_FPGA (U1.J10), DAC_Series_Termination26 (R80_26.1)
DAC_SPI_LDACn27: Fastino_FPGA (U1.M8), DAC_Series_Termination27 (R80_27.1)
DAC_SPI_LDACn28: Fastino_FPGA (U1.G14), DAC_Series_Termination28 (R80_28.1)
DAC_SPI_LDACn29: Fastino_FPGA (U1.L13), DAC_Series_Termination29 (R80_29.1)
DAC_SPI_LDACn30: Fastino_FPGA (U1.R5), DAC_Series_Termination30 (R80_30.1)
DAC_SPI_LDACn31: Fastino_FPGA (U1.N12), DAC_Series_Termination31 (R80_31.1)
DAC_SPI_LDACn32: Fastino_FPGA (U1.N6), DAC_Series_Termination32 (R80_32.1)
DAC_SPI_NSS1: Fastino_FPGA (U1.E5), DAC_Series_Termination1 (R66_1.1)
DAC_SPI_NSS2: Fastino_FPGA (U1.C5), DAC_Series_Termination2 (R66_2.1)
DAC_SPI_NSS3: Fastino_FPGA (U1.E6), DAC_Series_Termination3 (R66_3.1)
DAC_SPI_NSS4: Fastino_FPGA (U1.A6), DAC_Series_Termination4 (R66_4.1)
DAC_SPI_NSS5: Fastino_FPGA (U1.C7), DAC_Series_Termination5 (R66_5.1)
DAC_SPI_NSS6: Fastino_FPGA (U1.F9), DAC_Series_Termination6 (R66_6.1)
DAC_SPI_NSS7: Fastino_FPGA (U1.D10), DAC_Series_Termination7 (R66_7.1)
DAC_SPI_NSS8: Fastino_FPGA (U1.B11), DAC_Series_Termination8 (R66_8.1)
DAC_SPI_NSS9: Fastino_FPGA (U1.T2), DAC_Series_Termination9 (R66_9.1)
DAC_SPI_NSS10: Fastino_FPGA (U1.C11), DAC_Series_Termination10 (R66_10.1)
DAC_SPI_NSS11: Fastino_FPGA (U1.A16), DAC_Series_Termination11 (R66_11.1)
DAC_SPI_NSS12: Fastino_FPGA (U1.T7), DAC_Series_Termination12 (R66_12.1)
DAC_SPI_NSS13: Fastino_FPGA (U1.B16), DAC_Series_Termination13 (R66_13.1)
DAC_SPI_NSS14: Fastino_FPGA (U1.J13), DAC_Series_Termination14 (R66_14.1)
DAC_SPI_NSS15: Fastino_FPGA (U1.T9), DAC_Series_Termination15 (R66_15.1)
DAC_SPI_NSS16: Fastino_FPGA (U1.D13), DAC_Series_Termination16 (R66_16.1)
DAC_SPI_NSS17: Fastino_FPGA (U1.H16), DAC_Series_Termination17 (R66_17.1)
DAC_SPI_NSS18: Fastino_FPGA (U1.T11), DAC_Series_Termination18 (R66_18.1)
DAC_SPI_NSS19: Fastino_FPGA (U1.D16), DAC_Series_Termination19 (R66_19.1)
DAC_SPI_NSS20: Fastino_FPGA (U1.K14), DAC_Series_Termination20 (R66_20.1)
DAC_SPI_NSS21: Fastino_FPGA (U1.R15), DAC_Series_Termination21 (R66_21.1)
DAC_SPI_NSS22: Fastino_FPGA (U1.D15), DAC_Series_Termination22 (R66_22.1)
DAC_SPI_NSS23: Fastino_FPGA (U1.P16), DAC_Series_Termination23 (R66_23.1)
DAC_SPI_NSS24: Fastino_FPGA (U1.L10), DAC_Series_Termination24 (R66_24.1)
DAC_SPI_NSS25: Fastino_FPGA (U1.G15), DAC_Series_Termination25 (R66_25.1)
DAC_SPI_NSS26: Fastino_FPGA (U1.M16), DAC_Series_Termination26 (R66_26.1)
DAC_SPI_NSS27: Fastino_FPGA (U1.T5), DAC_Series_Termination27 (R66_27.1)
DAC_SPI_NSS28: Fastino_FPGA (U1.F15), DAC_Series_Termination28 (R66_28.1)
DAC_SPI_NSS29: Fastino_FPGA (U1.N16), DAC_Series_Termination29 (R66_29.1)
DAC_SPI_NSS30: Fastino_FPGA (U1.T3), DAC_Series_Termination30 (R66_30.1)
DAC_SPI_NSS31: Fastino_FPGA (U1.L11), DAC_Series_Termination31 (R66_31.1)
DAC_SPI_NSS32: Fastino_FPGA (U1.T1), DAC_Series_Termination32 (R66_32.1)
DAC_SPI_SDI1: Fastino_FPGA (U1.D3), DAC_Series_Termination1 (R69_1.1)
DAC_SPI_SDI2: Fastino_FPGA (U1.C4), DAC_Series_Termination2 (R69_2.1)
DAC_SPI_SDI3: Fastino_FPGA (U1.A2), DAC_Series_Termination3 (R69_3.1)
DAC_SPI_SDI4: Fastino_FPGA (U1.D6), DAC_Series_Termination4 (R69_4.1)
DAC_SPI_SDI5: Fastino_FPGA (U1.B6), DAC_Series_Termination5 (R69_5.1)
DAC_SPI_SDI6: Fastino_FPGA (U1.F7), DAC_Series_Termination6 (R69_6.1)
DAC_SPI_SDI7: Fastino_FPGA (U1.E9), DAC_Series_Termination7 (R69_7.1)
DAC_SPI_SDI8: Fastino_FPGA (U1.A10), DAC_Series_Termination8 (R69_8.1)
DAC_SPI_SDI9: Fastino_FPGA (U1.P5), DAC_Series_Termination9 (R69_9.1)
DAC_SPI_SDI10: Fastino_FPGA (U1.B12), DAC_Series_Termination10 (R69_10.1)
DAC_SPI_SDI11: Fastino_FPGA (U1.B13), DAC_Series_Termination11 (R69_11.1)
DAC_SPI_SDI12: Fastino_FPGA (U1.T8), DAC_Series_Termination12 (R69_12.1)
DAC_SPI_SDI13: Fastino_FPGA (U1.C14), DAC_Series_Termination13 (R69_13.1)
DAC_SPI_SDI14: Fastino_FPGA (U1.H13), DAC_Series_Termination14 (R69_14.1)
DAC_SPI_SDI15: Fastino_FPGA (U1.M9), DAC_Series_Termination15 (R69_15.1)
DAC_SPI_SDI16: Fastino_FPGA (U1.C12), DAC_Series_Termination16 (R69_16.1)
DAC_SPI_SDI17: Fastino_FPGA (U1.G16), DAC_Series_Termination17 (R69_17.1)
DAC_SPI_SDI18: Fastino_FPGA (U1.T14), DAC_Series_Termination18 (R69_18.1)
DAC_SPI_SDI19: Fastino_FPGA (U1.F14), DAC_Series_Termination19 (R69_19.1)
DAC_SPI_SDI20: Fastino_FPGA (U1.K16), DAC_Series_Termination20 (R69_20.1)
DAC_SPI_SDI21: Fastino_FPGA (U1.P14), DAC_Series_Termination21 (R69_21.1)
DAC_SPI_SDI22: Fastino_FPGA (U1.C16), DAC_Series_Termination22 (R69_22.1)
DAC_SPI_SDI23: Fastino_FPGA (U1.M14), DAC_Series_Termination23 (R69_23.1)
DAC_SPI_SDI24: Fastino_FPGA (U1.P10), DAC_Series_Termination24 (R69_24.1)
DAC_SPI_SDI25: Fastino_FPGA (U1.F16), DAC_Series_Termination25 (R69_25.1)
DAC_SPI_SDI26: Fastino_FPGA (U1.L16), DAC_Series_Termination26 (R69_26.1)
DAC_SPI_SDI27: Fastino_FPGA (U1.P8), DAC_Series_Termination27 (R69_27.1)
DAC_SPI_SDI28: Fastino_FPGA (U1.E16), DAC_Series_Termination28 (R69_28.1)
DAC_SPI_SDI29: Fastino_FPGA (U1.L14), DAC_Series_Termination29 (R69_29.1)
DAC_SPI_SDI30: Fastino_FPGA (U1.N7), DAC_Series_Termination30 (R69_30.1)
DAC_SPI_SDI31: Fastino_FPGA (U1.T16), DAC_Series_Termination31 (R69_31.1)
DAC_SPI_SDI32: Fastino_FPGA (U1.P4), DAC_Series_Termination32 (R69_32.1)
EEM0_SCL: Fastino_FPGA (U1.M15), Fastino_FPGA_LVDS (IC36.4 R74.2)
EEM0_SDA: Fastino_FPGA (U1.J11), Fastino_FPGA_LVDS (IC36.1 R78.2)
EEM1_SCL: Fastino_FPGA (U1.R4), Fastino_FPGA_LVDS (IC36.8 R110.2)
EEM1_SDA: Fastino_FPGA (U1.M7), Fastino_FPGA_LVDS (IC36.11 R84.2)
En_AFE_PWR: Fastino-DIOT (R202.1), Fastino_FPGA (U1.B4), Fastino_Supply (IC4.3 IC13.3 R48.2)
FLASH_SCK: Fastino_FPGA (U1.R11), Fastino_FPGA_Config (IC6.6 IC17.2 JP1.4)
FLASH_SDI: Fastino_FPGA (U1.P12), Fastino_FPGA_Config (IC6.5 IC17.3 JP1.2)
FLASH_SDO: Fastino_FPGA (U1.P11), Fastino_FPGA_Config (IC6.2 IC17.9 JP1.3)
FLASH_SS: Fastino_FPGA (U1.R12), Fastino_FPGA_Config (IC6.1 IC17.10 JP1.1 R204.1)
FPGA_CDONE: Fastino_FPGA (U1.M10), Fastino_FPGA_Config (JP1.10 R39.2 R41.1 T2.1), Fastino_FPGA_LVDS (IC36.5 IC36.6 IC36.12 IC36.13)
FPGA_CRESET: Fastino_FPGA (U1.N11), Fastino_FPGA_Config (JP1.9 R42.2 R44.1 R46.2)
FPGA_CSBSEL0: Fastino_FPGA (U1.K11), Fastino_FPGA_Config (R47.2 SW1.8)
FPGA_CSBSEL1: Fastino_FPGA (U1.P13), Fastino_FPGA_Config (R31.2 SW1.7)
I2C0_SCL: Fastino-DIOT (J12.15), Fastino_FPGA_Config (IC10.8 IC30.2), Fastino_FPGA_LVDS (9 pins)
I2C0_SDA: Fastino-DIOT (J12.14), Fastino_FPGA_Config (IC10.7 IC30.1), Fastino_FPGA_LVDS (9 pins)
LED0: Fastino-DIOT (R113.1), Fastino-connectors (IC33.9)
LED1: Fastino-DIOT (R114.1), Fastino-connectors (IC33.7)
LED2: Fastino-DIOT (R115.1), Fastino-connectors (IC33.5)
LED3: Fastino-DIOT (R119.1), Fastino-connectors (IC33.3)
LED4: Fastino-DIOT (R120.1), Fastino-connectors (IC33.18)
LED5: Fastino-DIOT (R121.1), Fastino-connectors (IC33.16)
LED6: Fastino-DIOT (R122.1), Fastino-connectors (IC33.14)
LED7: Fastino-DIOT (R123.1), Fastino-connectors (IC33.12)
PGOOD: Fastino_FPGA_Config (R42.1), Fastino_References (6 pins), Fastino_Supply (IC21.4 R51.2 T3.3)
PWR_EN: Fastino-DIOT (R201.2), Fastino_FPGA_LVDS (R86.2 R89.2), Fastino_Supply_Switching (IC8.D2), Fastino_DIOT_Connectors_P1_P6 (R183.2)
SERVMOD_3V3: Fastino_FPGA_LVDS (IC25.5 IC25.13), Fastino_DIOT_Connectors_P1_P6 (R205.1 R298.2)
SW0: Fastino_FPGA (U1.K15), Fastino_FPGA_Config (R33.1)
SW1: Fastino_FPGA (U1.B8), Fastino_FPGA_Config (R35.1)

## Assembly variants
STD_DIOT_ready: not fitted C35_1 C35_2 C35_3 C35_4 C35_5 C35_6 C35_7 C35_8 C35_9 C35_10 C35_11 C35_12 C35_13 C35_14 C35_15 C35_16 C35_17 C35_18 C35_19 C35_20 C35_21 C35_22 C35_23 C35_24 C35_25 C35_26 C35_27 C35_28 C35_29 C35_30 C35_31 C35_32 C66_1 C66_2 C66_3 C66_4 C66_5 C66_6 C66_7 C66_8 C66_9 C66_10 C66_11 C66_12 C66_13 C66_14 C66_15 C66_16 C66_17 C66_18 C66_19 C66_20 C66_21 C66_22 C66_23 C66_24 C66_25 C66_26 C66_27 C66_28 C66_29 C66_30 C66_31 C66_32 C68_1 C68_2 C68_3 C68_4 C68_5 C68_6 C68_7 C68_8 C68_9 C68_10 C68_11 C68_12 C68_13 C68_14 C68_15 C68_16 C68_17 C68_18 C68_19 C68_20 C68_21 C68_22 C68_23 C68_24 C68_25 C68_26 C68_27 C68_28 C68_29 C68_30 C68_31 C68_32 C89_1 C89_2 C89_3 C89_4 C89_5 C89_6 C89_7 C89_8 C89_9 C89_10 C89_11 C89_12 C89_13 C89_14 C89_15 C89_16 C89_17 C89_18 C89_19 C89_20 C89_21 C89_22 C89_23 C89_24 C89_25 C89_26 C89_27 C89_28 C89_29 C89_30 C89_31 C89_32 C94 C107 IC10 IC12 IC15 IC16 IC26 J2 J11 R39 R46 R202 R235 R236 R238 R239 R240 R241 R242 R243 R244 R245 R246 R247 R248 R249 R250 R251 R252 R253 R254 R255 R256 R257 R258 R259 R260 R261 R262 R263 R264 R265 R266 R267 R268 R269 R270 R271 R309 RN1_1 RN1_2 RN1_3 RN1_4 RN1_5 RN1_6 RN1_7 RN1_8 RN1_9 RN1_10 RN1_11 RN1_12 RN1_13 RN1_14 RN1_15 RN1_16 RN1_17 RN1_18 RN1_19 RN1_20 RN1_21 RN1_22 RN1_23 RN1_24 RN1_25 RN1_26 RN1_27 RN1_28 RN1_29 RN1_30 RN1_31 RN1_32 RN2 RN3 SW2
STD: not fitted C11 C15 C35_1 C35_2 C35_3 C35_4 C35_5 C35_6 C35_7 C35_8 C35_9 C35_10 C35_11 C35_12 C35_13 C35_14 C35_15 C35_16 C35_17 C35_18 C35_19 C35_20 C35_21 C35_22 C35_23 C35_24 C35_25 C35_26 C35_27 C35_28 C35_29 C35_30 C35_31 C35_32 C66_1 C66_2 C66_3 C66_4 C66_5 C66_6 C66_7 C66_8 C66_9 C66_10 C66_11 C66_12 C66_13 C66_14 C66_15 C66_16 C66_17 C66_18 C66_19 C66_20 C66_21 C66_22 C66_23 C66_24 C66_25 C66_26 C66_27 C66_28 C66_29 C66_30 C66_31 C66_32 C68_1 C68_2 C68_3 C68_4 C68_5 C68_6 C68_7 C68_8 C68_9 C68_10 C68_11 C68_12 C68_13 C68_14 C68_15 C68_16 C68_17 C68_18 C68_19 C68_20 C68_21 C68_22 C68_23 C68_24 C68_25 C68_26 C68_27 C68_28 C68_29 C68_30 C68_31 C68_32 C89_1 C89_2 C89_3 C89_4 C89_5 C89_6 C89_7 C89_8 C89_9 C89_10 C89_11 C89_12 C89_13 C89_14 C89_15 C89_16 C89_17 C89_18 C89_19 C89_20 C89_21 C89_22 C89_23 C89_24 C89_25 C89_26 C89_27 C89_28 C89_29 C89_30 C89_31 C89_32 C94 C95 C100 C103 C108 C109 D3 D5 D6 D7 IC10 IC12 IC23 IC24 IC25 IC28 J2 J8 J9 R3 R39 R46 R183 R185 R187 R202 R205 R220 R221 R222 R223 R224 R225 R226 R227 R228 R229 R233 R235 R236 R238 R239 R240 R241 R242 R243 R244 R245 R246 R247 R248 R249 R250 R251 R252 R253 R254 R255 R256 R257 R258 R259 R260 R261 R262 R263 R264 R265 R266 R267 R268 R269 R270 R271 R298 R309 R310 RN1_1 RN1_2 RN1_3 RN1_4 RN1_5 RN1_6 RN1_7 RN1_8 RN1_9 RN1_10 RN1_11 RN1_12 RN1_13 RN1_14 RN1_15 RN1_16 RN1_17 RN1_18 RN1_19 RN1_20 RN1_21 RN1_22 RN1_23 RN1_24 RN1_25 RN1_26 RN1_27 RN1_28 RN1_29 RN1_30 RN1_31 RN1_32 RN2 T9 T10 T11 T12
DIOT_High_Precision: not fitted C35_1 C35_2 C35_3 C35_4 C35_5 C35_6 C35_7 C35_8 C35_9 C35_10 C35_11 C35_12 C35_13 C35_14 C35_15 C35_16 C35_17 C35_18 C35_19 C35_20 C35_21 C35_22 C35_23 C35_24 C35_25 C35_26 C35_27 C35_28 C35_29 C35_30 C35_31 C35_32 C66_1 C66_2 C66_3 C66_4 C66_5 C66_6 C66_7 C66_8 C66_9 C66_10 C66_11 C66_12 C66_13 C66_14 C66_15 C66_16 C66_17 C66_18 C66_19 C66_20 C66_21 C66_22 C66_23 C66_24 C66_25 C66_26 C66_27 C66_28 C66_29 C66_30 C66_31 C66_32 C68_1 C68_2 C68_3 C68_4 C68_5 C68_6 C68_7 C68_8 C68_9 C68_10 C68_11 C68_12 C68_13 C68_14 C68_15 C68_16 C68_17 C68_18 C68_19 C68_20 C68_21 C68_22 C68_23 C68_24 C68_25 C68_26 C68_27 C68_28 C68_29 C68_30 C68_31 C68_32 C89_1 C89_2 C89_3 C89_4 C89_5 C89_6 C89_7 C89_8 C89_9 C89_10 C89_11 C89_12 C89_13 C89_14 C89_15 C89_16 C89_17 C89_18 C89_19 C89_20 C89_21 C89_22 C89_23 C89_24 C89_25 C89_26 C89_27 C89_28 C89_29 C89_30 C89_31 C89_32 C94 IC10 IC12 IC15 IC16 R39 R46 R187 R202 R309 RN1_1 RN1_2 RN1_3 RN1_4 RN1_5 RN1_6 RN1_7 RN1_8 RN1_9 RN1_10 RN1_11 RN1_12 RN1_13 RN1_14 RN1_15 RN1_16 RN1_17 RN1_18 RN1_19 RN1_20 RN1_21 RN1_22 RN1_23 RN1_24 RN1_25 RN1_26 RN1_27 RN1_28 RN1_29 RN1_30 RN1_31 RN1_32; alternate parts RN5_1 -> RN_10K_10K_VISHAY_Y1747V0008QT9, RN5_2 -> RN_10K_10K_VISHAY_Y1747V0008QT9, RN5_8 -> RN_10K_10K_VISHAY_Y1747V0008QT9, RN5_7 -> RN_10K_10K_VISHAY_Y1747V0008QT9, RN5_6 -> RN_10K_10K_VISHAY_Y1747V0008QT9, RN5_5 -> RN_10K_10K_VISHAY_Y1747V0008QT9, RN5_4 -> RN_10K_10K_VISHAY_Y1747V0008QT9, RN5_3 -> RN_10K_10K_VISHAY_Y1747V0008QT9, RN5_32 -> RN_10K_10K_VISHAY_Y1747V0008QT9, RN5_31 -> RN_10K_10K_VISHAY_Y1747V0008QT9, RN5_30 -> RN_10K_10K_VISHAY_Y1747V0008QT9, RN5_29 -> RN_10K_10K_VISHAY_Y1747V0008QT9, RN5_28 -> RN_10K_10K_VISHAY_Y1747V0008QT9, RN5_27 -> RN_10K_10K_VISHAY_Y1747V0008QT9, RN5_26 -> RN_10K_10K_VISHAY_Y1747V0008QT9, RN5_25 -> RN_10K_10K_VISHAY_Y1747V0008QT9, RN5_24 -> RN_10K_10K_VISHAY_Y1747V0008QT9, RN5_23 -> RN_10K_10K_VISHAY_Y1747V0008QT9, RN5_22 -> RN_10K_10K_VISHAY_Y1747V0008QT9, RN5_21 -> RN_10K_10K_VISHAY_Y1747V0008QT9, RN5_20 -> RN_10K_10K_VISHAY_Y1747V0008QT9, RN5_19 -> RN_10K_10K_VISHAY_Y1747V0008QT9, RN5_18 -> RN_10K_10K_VISHAY_Y1747V0008QT9, RN5_17 -> RN_10K_10K_VISHAY_Y1747V0008QT9, RN5_16 -> RN_10K_10K_VISHAY_Y1747V0008QT9, RN5_15 -> RN_10K_10K_VISHAY_Y1747V0008QT9, RN5_14 -> RN_10K_10K_VISHAY_Y1747V0008QT9, RN5_13 -> RN_10K_10K_VISHAY_Y1747V0008QT9, RN5_12 -> RN_10K_10K_VISHAY_Y1747V0008QT9, RN5_11 -> RN_10K_10K_VISHAY_Y1747V0008QT9, RN5_10 -> RN_10K_10K_VISHAY_Y1747V0008QT9, RN5_9 -> RN_10K_10K_VISHAY_Y1747V0008QT9, RN2 -> RN_10K_10K_VISHAY_Y1747V0008QT9, RN3 -> RN_10K_10K_VISHAY_Y1747V0008QT9